# Altium schematic sheet Ethernet.SchDoc: Ethernet controller
size A4; DrawnBy: oaba200
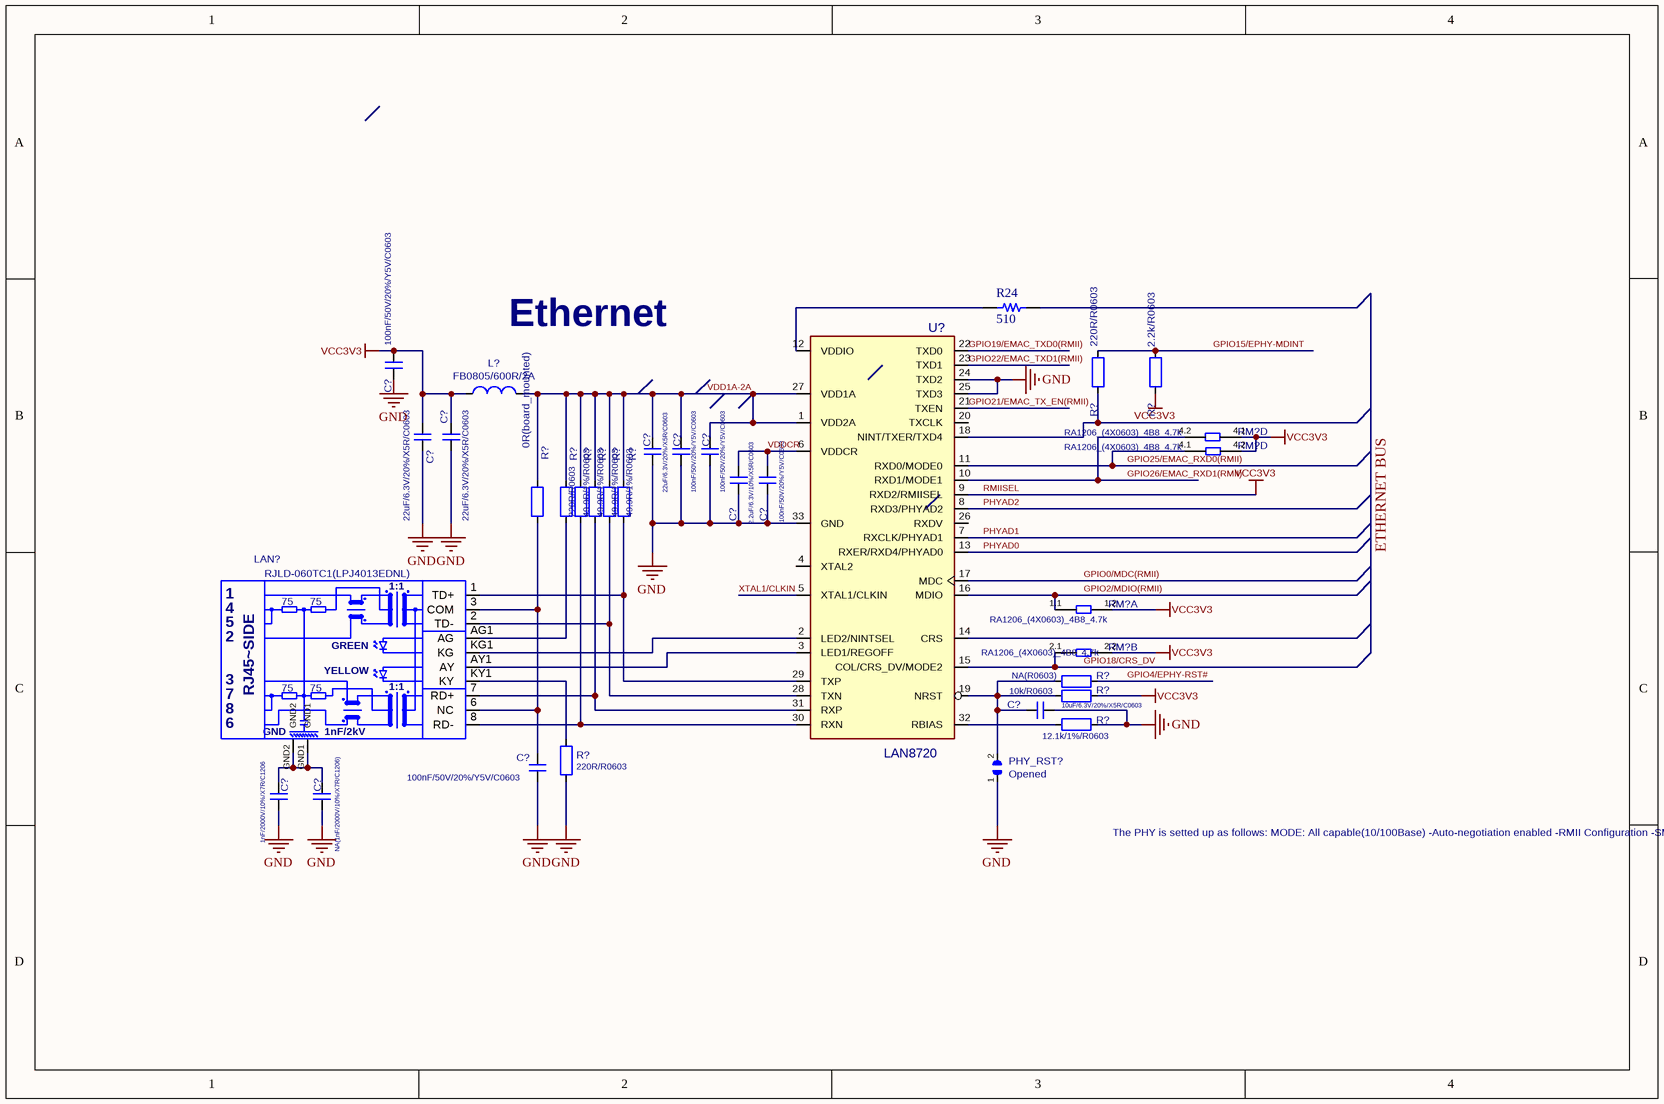
[diagram p0: Ethernet.SchDoc]

## Parts
(Parts that share a designator on the sheet are numbered #1, #2 ... from top to bottom, then left to right.)
C?#1  100nF/50V/20%/Y5V/C0603  [C_0603_5MIL_DWS]
C?#2  22uF/6.3V/20%/X5R/C0603  [C_0603_5MIL_DWS]
C?#3  22uF/6.3V/20%/X5R/C0603  [C_0603_5MIL_DWS]
C?#4  22uF/6.3V/20%/X5R/C0603  [C_0603_5MIL_DWS]
C?#5  100nF/50V/20%/Y5V/C0603  [C_0603_5MIL_DWS]
C?#6  100nF/50V/20%/Y5V/C0603  [C_0603_5MIL_DWS]
C?#7  2.2uF/6.3V/10%/X5R/C0603  [C_0603_5MIL_DWS]
C?#8  100nF/50V/20%/Y5V/C0603  [C_0603_5MIL_DWS]
C?#9  10uF/6.3V/20%/X5R/C0603  [C_0603_5MIL_DWS]
C?#10  100nF/50V/20%/Y5V/C0603  [C_0603_5MIL_DWS]
C?#11  1nF/2000V/10%/X7R/C1206  [C_1206_5MIL_DWS_ISO]
C?#12  NA(1nF/2000V/10%/X7R/C1206)  [C_1206_5MIL_DWS_ISO]
L?  FB0805/600R/2A  [L_0805_5MIL_DWS]
LAN?  RJLD-060TC1(LPJ4013EDNL)  [RJLBC-060TC1]
PHY_RST?  Opened  [SJ]
R24  510  [RES 0805_2012]
R?#1  220R/R0603  [R_0603_5MIL_DWS]
R?#2  2.2k/R0603  [R_0603_5MIL_DWS]
R?#3  0R(board_mounted)  [0R_0603]
R?#4  220R/R0603  [R_0603_5MIL_DWS]
R?#5  49.9R/1%/R0603  [R_0603_5MIL_DWS]
R?#6  49.9R/1%/R0603  [R_0603_5MIL_DWS]
R?#7  49.9R/1%/R0603  [R_0603_5MIL_DWS]
R?#8  49.9R/1%/R0603  [R_0603_5MIL_DWS]
R?#9  NA(R0603)  [R_0603_5MIL_DWS]
R?#10  10k/R0603  [R_0603_5MIL_DWS]
R?#11  12.1k/1%/R0603  [R_0603_5MIL_DWS]
R?#12  220R/R0603  [R_0603_5MIL_DWS]
RM?#1  RA1206_(4X0603)_4B8_4.7k  [R_MATRIX_4]  (part D of 4)
RM?#2  RA1206_(4X0603)_4B8_4.7k  [R_MATRIX_4]  (part D of 4)
RM?#3  RA1206_(4X0603)_4B8_4.7k  [R_MATRIX_4]  (part A of 4)
RM?#4  RA1206_(4X0603)_4B8_4.7k  [R_MATRIX_4]  (part B of 4)
U?  LAN8720  [QFN32_EP(33)_5.00x5.00x0.90mm_Pitch_0.50mm]

## Nets
GND: C?#1.2 C?#2.2 C?#3.2 C?#4.2 C?#5.2 C?#6.2 C?#7.2 C?#8.2 C?#9.1 C?#10.2 C?#11.2 C?#12.2 PHY_RST?.1 R?#11.2 R?#12.2 U?.24(TXD2) U?.25(TXD3) U?.33(GND)
RMIISEL: C?#1.1 C?#2.1 C?#3.1 L?.1 R?#2.1 R?#10.2 RM?#1.4.1 RM?#2.4.2 RM?#3.1.2 RM?#4.2.2 U?.9(RXD2/RMIISEL)  [also labelled VCC3V3]
GPIO0/MDC(RMII): U?.17(MDC)
GPIO2/MDIO(RMII): RM?#3.1.1 U?.16(MDIO)
GPIO4/EPHY-RST#: R?#9.2
GPIO15/EPHY-MDINT: R?#1.2 R?#2.2
GPIO18/CRS_DV: RM?#4.2.1 U?.15(COL/CRS_DV/MODE2)
GPIO19/EMAC_TXD0(RMII): U?.22(TXD0)
GPIO21/EMAC_TX_EN(RMII): U?.21(TXEN)
GPIO22/EMAC_TXD1(RMII): U?.23(TXD1)
GPIO25/EMAC_RXD0(RMII): RM?#2.4.1 U?.11(RXD0/MODE0)
GPIO26/EMAC_RXD1(RMII): RM?#1.4.2 U?.10(RXD1/MODE1)
PHYAD0: U?.13(RXER/RXD4/PHYAD0)
PHYAD1: U?.7(RXCLK/PHYAD1)
PHYAD2: U?.8(RXD3/PHYAD2)
VDD1A-2A: C?#4.1 C?#5.1 C?#6.1 L?.2 R?#3.1 R?#4.1 R?#5.1 R?#6.1 R?#7.1 R?#8.1 U?.1(VDD2A) U?.27(VDD1A)
VDDCR: C?#7.1 C?#8.1 U?.6(VDDCR)
XTAL1/CLKIN: U?.5(XTAL1/CLKIN)
NetC?#9_2: C?#9.2 PHY_RST?.2 R?#9.1 R?#10.1 U?.19(NRST)
NetC?#10_1: C?#10.1 LAN?.3(COM) LAN?.6(NC) R?#3.2
NetC?#11_1: C?#11.1 C?#12.1 LAN?.GND1 LAN?.GND2
NetLAN?_1: LAN?.1(TD+) R?#8.2 U?.29(TXP)
NetLAN?_2: LAN?.2(TD-) R?#7.2 U?.28(TXN)
NetLAN?_7: LAN?.7(RD+) R?#6.2 U?.31(RXP)
NetLAN?_8: LAN?.8(RD-) R?#5.2 U?.30(RXN)
NetLAN?_AG1: LAN?.AG1(AG) R?#4.2
NetLAN?_AY1: LAN?.AY1(AY) U?.3(LED1/REGOFF)
NetLAN?_KG1: LAN?.KG1(KG) U?.2(LED2/NINTSEL)
NetLAN?_KY1: LAN?.KY1(KY) R?#12.1
NetR24_1: R24.1 U?.12(VDDIO)
NetR?#1_1: R?#1.1 U?.18(NINT/TXER/TXD4)
NetR?#11_1: R?#11.1 U?.32(RBIAS)

Not connected (* = marked no-connect by the designer): R24 2; U? 4(XTAL2) 14(CRS) 20(TXCLK) 26(RXDV)

## Buses and harness runs
bus ETHERNET BUS

## Notes on the sheet
- Ethernet
- (near U?) In RMII
  Mode
- The PHY is setted up as follows:
  MODE: All capable(10/100Base)
  -Auto-negotiation enabled
  -RMII Configuration
  -SMI address: 0x00
- (in symbol RJLBC-060TC1_GND) 1:1; 75; 4; 5; GREEN; RJ45~SIDE; YELLOW; GND; 1nF/2kV

## Library data of the parts
C?#1-C?#12 = C: Fieldname 1: Value 1; Fieldname2: Value2; Fieldname3: Value3
  C?#1 C?#5 C?#6 C?#8 C?#10: Value: 100nF/50V/20%/Y5V/C0603; Footprint: OLIMEX_RLC-FP:C_0603_5MIL_DWS
  C?#2-C?#4: Value: 22uF/6.3V/20%/X5R/C0603; Footprint: OLIMEX_RLC-FP:C_0603_5MIL_DWS
  C?#7: Value: 2.2uF/6.3V/10%/X5R/C0603; Footprint: OLIMEX_RLC-FP:C_0603_5MIL_DWS
  C?#9: Value: 10uF/6.3V/20%/X5R/C0603; Footprint: OLIMEX_RLC-FP:C_0603_5MIL_DWS
  C?#11: Value: 1nF/2000V/10%/X7R/C1206; Footprint: OLIMEX_RLC-FP:C_1206_5MIL_DWS_ISO
  C?#12: Value: NA(1nF/2000V/10%/X7R/C1206); Footprint: OLIMEX_RLC-FP:C_1206_5MIL_DWS_ISO
L? = L: Fieldname 1: Value 1; Fieldname2: Value2; Fieldname3: Value3; Value: FB0805/600R/2A; Footprint: OLIMEX_RLC-FP:L_0805_5MIL_DWS
LAN? = RJLBC-060TC1_GND: Fieldname 1: Value 1; Fieldname2: Value2; Fieldname3: Value3; Value: RJLD-060TC1(LPJ4013EDNL); Footprint: OLIMEX_Connectors-FP:RJLBC-060TC1
PHY_RST? = SJ: Fieldname 1: Value 1; Fieldname2: Value2; Fieldname3: Value3; Value: Opened; Footprint: OLIMEX_Jumpers-FP:SJ
R24 = Resistor: SMT Resistor; VALUE: 510
R?#1-R?#12 = R: Fieldname 1: Value 1; Fieldname2: Value2; Fieldname3: Value3
  R?#1 R?#4 R?#12: Value: 220R/R0603; Footprint: OLIMEX_RLC-FP:R_0603_5MIL_DWS
  R?#2: Value: 2.2k/R0603; Footprint: OLIMEX_RLC-FP:R_0603_5MIL_DWS
  R?#3: Value: 0R(board_mounted); Footprint: OLIMEX_RLC-FP:0R_0603
  R?#5-R?#8: Value: 49.9R/1%/R0603; Footprint: OLIMEX_RLC-FP:R_0603_5MIL_DWS
  R?#9: Value: NA(R0603); Footprint: OLIMEX_RLC-FP:R_0603_5MIL_DWS
  R?#10: Value: 10k/R0603; Footprint: OLIMEX_RLC-FP:R_0603_5MIL_DWS
  R?#11: Value: 12.1k/1%/R0603; Footprint: OLIMEX_RLC-FP:R_0603_5MIL_DWS
RM?#1 RM?#3 RM?#4 = RA1206_(4x0603)_4B8_Smashed: Value: RA1206_(4X0603)_4B8_4.7k; Footprint: OLIMEX_RLC-FP:R_MATRIX_4
RM?#2 = RA1206_(4x0603)_4B8_Smashed: Fieldname 1: Value 1; Fieldname2: Value2; Fieldname3: Value3; Value: RA1206_(4X0603)_4B8_4.7k; Footprint: OLIMEX_RLC-FP:R_MATRIX_4
U? = LAN8720: Fieldname 1: Value 1; Fieldname2: Value2; Fieldname3: Value3; Footprint: OLIMEX_IC-FP:QFN32_EP(33)_5.00x5.00x0.90mm_Pitch_0.50mm; Value: LAN8720